# Altium schematic sheet Output.SchDoc
size A4; SheetNumber: 6; SheetTotal: 6
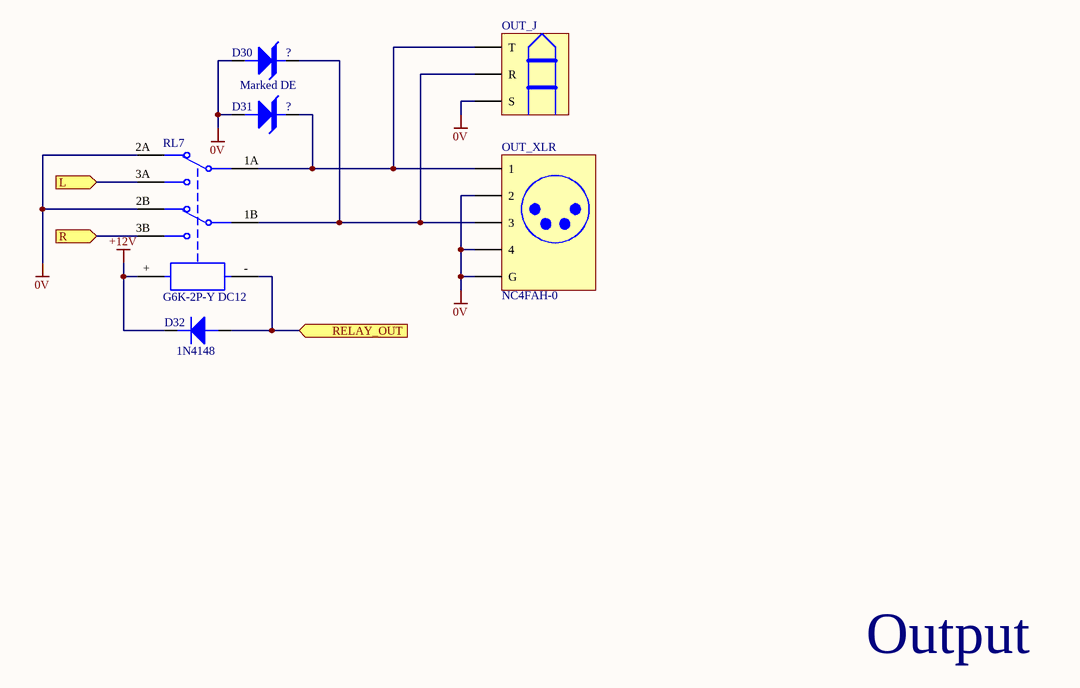
[diagram p0: Output.SchDoc]

## Parts
D30  TVS  [DIOM4336X24N]  (value not drawn)
D31  TVS  [DIOM4336X24N]  (value not drawn)
D32  1N4148
OUT_J  SJ-63053A  [SJ-63053A]  (value not drawn)
OUT_XLR  NC4FAH-0
RL7  G6K-2P-Y DC12  [G6K-2P-Y]

## Ports
L (in, see Top[3B]), R (in, see Top[3B]), RELAY_OUT (in, see Top[3B], STM[7D])

## Nets
0V: D30.A D31.A OUT_J.S OUT_XLR.2 OUT_XLR.4 OUT_XLR.G RL7.2A RL7.2B
+12V: D32.K RL7.+
L: RL7.3A ; port L
R: RL7.3B ; port R
RELAY_OUT: D32.A RL7.- ; port RELAY_OUT
NetD30_K: D30.K OUT_J.R OUT_XLR.3 RL7.1B
NetD31_K: D31.K OUT_J.T OUT_XLR.1 RL7.1A

## Notes on the sheet
- Marked DE
- Output

## Library data of the parts
D30 D31 = TVS: Generic TVS diode; Manufacturer: Bourns; Manufacturer Part Number: SMBJ30A; Breakdown Voltage-Nom: 35.8V; JEDEC-95 Code: DO-214AA; Diode Element Material: SILICON; Min Breakdown Voltage: 33.3V; Max Power Dissipation: 5W; Rep Pk Reverse Voltage-Max: 30V; Number of Elements: 1; Reference Standard: IEC-61000-4-2; Diode Type: TRANS VOLTAGE SUPPRESSOR; Max Breakdown Voltage: 36.8V; Non-rep Peak Rev Power Dis-Max: 600W; Package Body Material: Plastic; Polarity: Unidirectional; Qualification Status: Not Qualified; Min Operating Temperature: -55°C; REACH SVHC: No SVHC; Terminal Finish: Tin; Moisture Sensitivity Level: 1; Number of Pins: 2; JESD-30 Code: R-PDSO-C2; Technology: AVALANCHE; Terminal Position: DUAL; Max Operating Temperature: 150°C; Package Style: SMALL OUTLINEMeter; Package Shape: Rectangular; Terminal Form: C BEND; RoHS Compliant: Yes; Surface Mount: Yes; JESD-609 Code: e3; Sub-Category: TVS; Category: Diode; Component Type: Standard_Diode; Value: ?
D32 = 1N4148: Generic small signal diode; Manufacturer Part Number: BAT48ZFILM; Number of Elements: 1; Rep Pk Reverse Voltage-Max: 40V; Package Body Material: Plastic; Diode Type: RECTIFIER; Forward Voltage-Max (VF): 250mV; Non-rep Pk Forward Current-Max: 2A; Diode Element Material: SILICON; Time @ Peak Reflow Temperature-Max (s): 30s; Max Output Current: 350mA; Qualification Status: Not Qualified; Peak Reflow Temperature (Cel): 260°C; Max Operating Temperature: 150°C; Terminal Position: DUAL; Technology: SCHOTTKY; JESD-30 Code: R-PDSO-G2; Category: Diode; Surface Mount: Yes; RoHS Compliant: Yes; Manufacturer: Generic; Number of Pins: 2; Sub-Category: Signal; Terminal Form: Gull Wing; REACH SVHC: Yes; JESD-609 Code: e3; Package Shape: Rectangular; Package Style: SMALL OUTLINEMeter; Terminal Finish: Tin; Component Type: Standard_Diode; Value: 1N4148
OUT_J = SJ-63053A: 6.35 mm, Stereo, Right Angle, Through Hole Mount, 3 Conductors, 0 Internal Switches, Audio Jack Connector; Manufacturer: Same Sky; Category: Connector; Sub-Category: Jack; Value: SJ-63053A
OUT_XLR = NC4FAH-0: 4 pole XLR female receptacle with 1/4" stereo jack, horizontal PCB mount; Manufacturer: Neutrik; Category: Connector; Sub-Category: XLR; Value: NC4FAH-0
RL7 = G6K-2P-Y DC12: Low Signal Relays - PCB Gullwing NoLatch 3.2 DPDT 12VDC 100mW T/R; Manufacturer: Omron; Category: Switch; Sub-Category: Relay; Value: G6K-2P-Y DC12